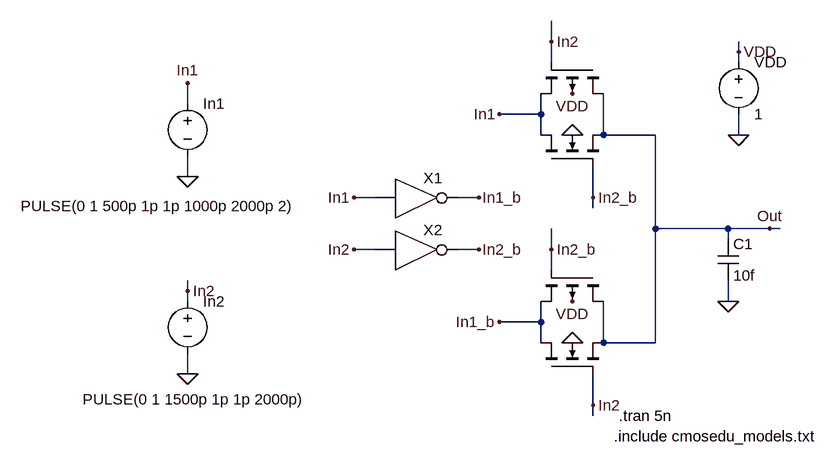
[diagram p0: schematic 10-TG-XOR2.asc]
10-TG-XOR2.asc, the LTspice schematic file:
Version 4
SHEET 1 1820 680
WIRE 896 -784 896 -816
WIRE 1184 -768 1184 -784
WIRE 896 -752 896 -784
WIRE 1184 -752 1184 -768
WIRE 336 -688 336 -720
WIRE 880 -672 880 -704
WIRE 880 -672 816 -672
WIRE 880 -640 880 -672
WIRE 976 -640 976 -704
WIRE 1056 -640 976 -640
WIRE 1184 -640 1184 -672
WIRE 336 -576 336 -608
WIRE 624 -544 592 -544
WIRE 784 -544 752 -544
WIRE 960 -544 960 -592
WIRE 960 -528 960 -544
WIRE 1056 -496 1056 -640
WIRE 1168 -496 1056 -496
WIRE 1232 -496 1168 -496
WIRE 1248 -496 1232 -496
WIRE 1168 -480 1168 -496
WIRE 624 -464 592 -464
WIRE 784 -464 752 -464
WIRE 896 -464 896 -496
WIRE 896 -432 896 -464
WIRE 336 -400 336 -416
WIRE 336 -384 336 -400
WIRE 1168 -384 1168 -416
WIRE 880 -352 880 -384
WIRE 880 -352 816 -352
WIRE 880 -320 880 -352
WIRE 976 -320 976 -384
WIRE 1056 -320 1056 -496
WIRE 1056 -320 976 -320
WIRE 336 -272 336 -304
WIRE 960 -224 960 -272
WIRE 960 -208 960 -224
FLAG 1184 -640 0
FLAG 1184 -768 VDD
FLAG 928 -320 0
FLAG 928 -384 VDD
FLAG 928 -640 0
FLAG 928 -704 VDD
FLAG 896 -784 In2
FLAG 896 -464 In2_b
FLAG 960 -544 In2_b
FLAG 960 -224 In2
FLAG 816 -352 In1_b
FLAG 816 -672 In1
FLAG 1168 -384 0
FLAG 1232 -496 Out
FLAG 592 -544 In1
FLAG 592 -464 In2
FLAG 784 -544 In1_b
FLAG 784 -464 In2_b
FLAG 336 -576 0
FLAG 336 -272 0
FLAG 336 -720 In1
FLAG 336 -400 In2
SYMBOL voltage 1184 -768 R0
WINDOW 123 24 126 Left 2
WINDOW 39 24 111 Left 2
SYMATTR InstName VDD
SYMATTR Value 1
SYMBOL nmos4 880 -272 R270
WINDOW 0 86 42 Invisible 2
WINDOW 3 82 140 Invisible 2
SYMATTR InstName M7
SYMATTR Value N_50n
SYMATTR Value2 l=50n w=500n
SYMBOL pmos4 976 -432 R90
WINDOW 0 71 26 Invisible 2
WINDOW 3 75 133 Invisible 2
SYMATTR InstName M3
SYMATTR Value P_50n
SYMATTR Value2 l=50n w=1u
SYMBOL nmos4 880 -592 R270
WINDOW 0 86 42 Invisible 2
WINDOW 3 82 140 Invisible 2
SYMATTR InstName M13
SYMATTR Value N_50n
SYMATTR Value2 l=50n w=500n
SYMBOL pmos4 976 -752 R90
WINDOW 0 71 26 Invisible 2
WINDOW 3 75 133 Invisible 2
SYMATTR InstName M14
SYMATTR Value P_50n
SYMATTR Value2 l=50n w=1u
SYMBOL cap 1152 -480 R0
SYMATTR InstName C1
SYMATTR Value 10f
SYMBOL NOT 656 -576 R0
SYMATTR InstName X1
SYMBOL NOT 656 -496 R0
SYMATTR InstName X2
SYMBOL voltage 336 -704 R0
WINDOW 3 -257 173 Left 2
SYMATTR InstName In1
SYMATTR Value PULSE(0 1 500p 1p 1p 1000p 2000p 2)
SYMBOL voltage 336 -400 R0
WINDOW 3 -162 167 Left 2
SYMATTR InstName In2
SYMATTR Value PULSE(0 1 1500p 1p 1p 2000p)
TEXT 992 -176 Left 2 !.include cmosedu_models.txt
TEXT 1000 -208 Left 2 !.tran 5n

The netlist it stands for:
* 10-TG-XOR2.asc
VDD VDD 0 1
M7 In1_b In2 Out 0 N_50n l=50n w=500n
M3 Out In2_b In1_b VDD P_50n l=50n w=1u
M13 In1 In2_b Out 0 N_50n l=50n w=500n
M14 Out In2 In1 VDD P_50n l=50n w=1u
C1 Out 0 10f
XX1 In1 In1_b NOT  ; pins In Out
XX2 In2 In2_b NOT  ; pins In Out
V§In1 In1 0 PULSE(0 1 500p 1p 1p 1000p 2000p 2)
V§In2 In2 0 PULSE(0 1 1500p 1p 1p 2000p)
.model NMOS NMOS
.model PMOS PMOS
.lib standard.mos
.include cmosedu_models.txt
.tran 5n
.backanno
.end